# Altium project FIRST.PrjPcb
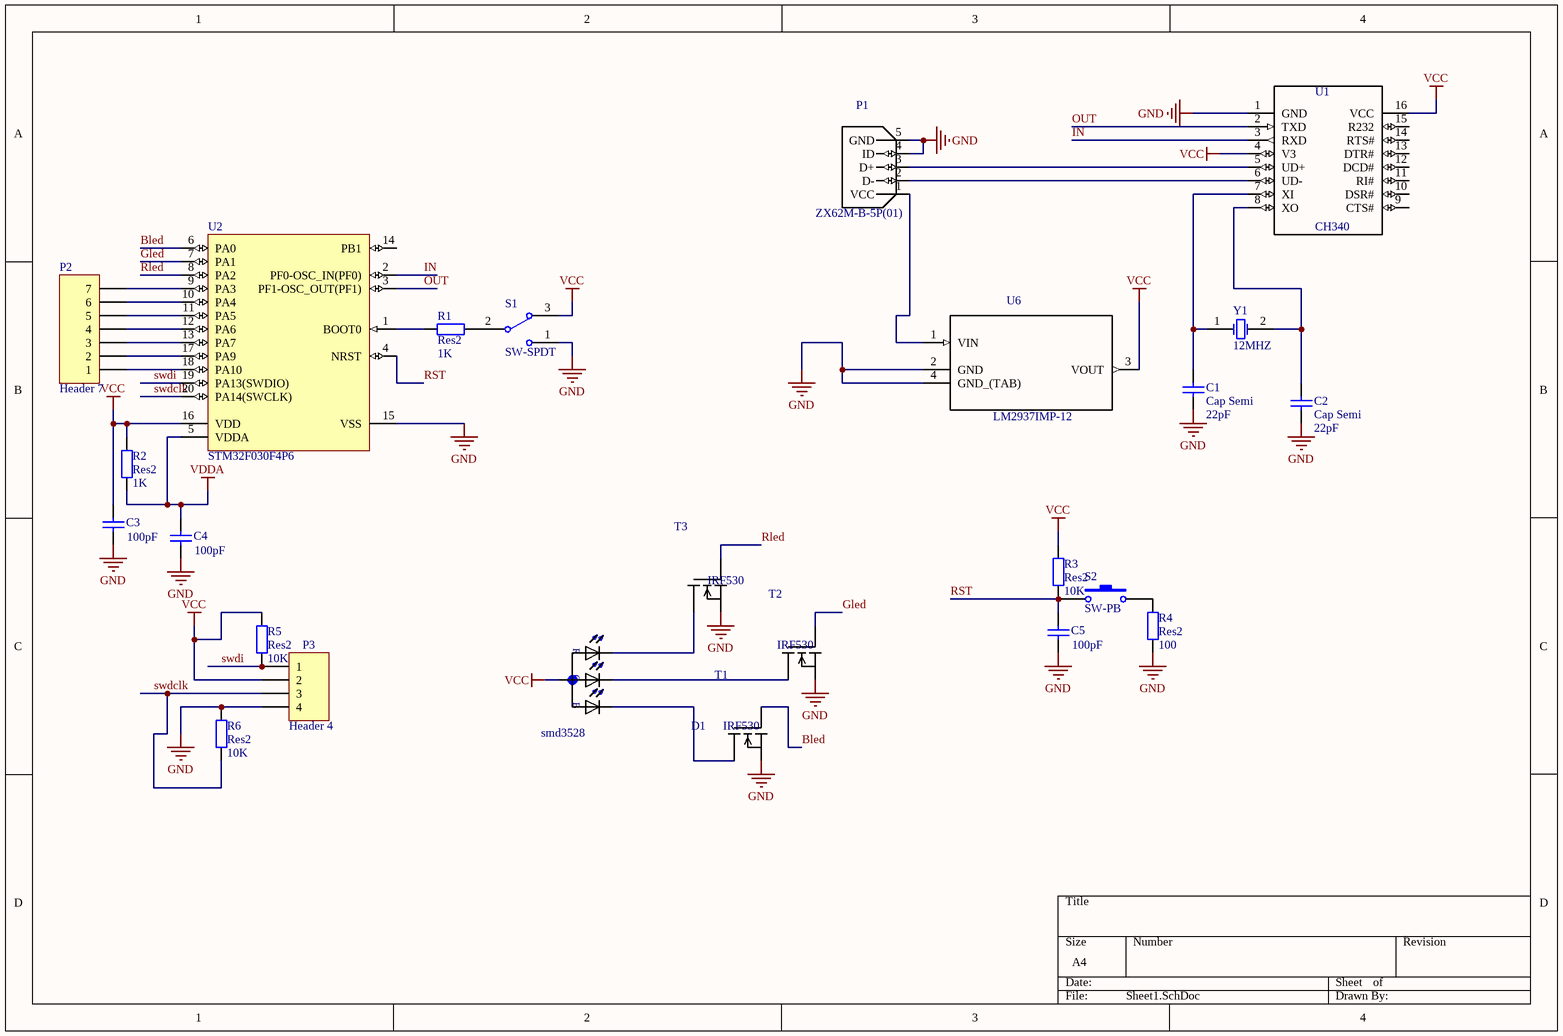
[diagram p0: Sheet1.SchDoc]
1 sheet, 24 parts. Net scope: global (net labels, ports and power ports of the same name join across sheets).
Board file: PCB3.PcbDoc

## Sheet Sheet1.SchDoc
size A4

### Parts
C1  Cap Semi  value 22pF  [C1206]
C2  Cap Semi  value 22pF  [C1206]
C3  value 100pF  [C1206]  (hidden comment: Cap Semi)
C4  value 100pF  [C1206]  (hidden comment: Cap Semi)
C5  value 100pF  [C1206]  (hidden comment: Cap Semi)
D1  smd3528  [PLCC4]
P1  ZX62M-B-5P(01)  [HRS_ZX62M-B-5P(01)]
P2  Header 7  [HDR1X7]
P3  Header 4  [HDR1X4]
R1  Res2  value 1K  [AXIAL-0.4]
R2  Res2  value 1K  [AXIAL-0.4]
R3  Res2  value 10K  [AXIAL-0.4]
R4  Res2  value 100  [AXIAL-0.4]
R5  Res2  value 10K  [AXIAL-0.4]
R6  Res2  value 10K  [AXIAL-0.4]
S1  SW-SPDT  [TL36WW15050]
S2  SW-PB  [SPST-2]
T1  IRF530  [TO220]
T2  IRF530  [TO220]
T3  IRF530  [TO220]
U1  CH340  [SO16]
U2  STM32F030F4P6  [STM-TSSOP20_N]
U6  LM2937IMP-12  [SOT230P700X180-4N]
Y1  12MHZ  [R38]

### Nets
GND: C1.1 C2.1 C3.1 C4.1 C5.1 P1.4(ID) P1.5(GND) P3.4 R4.1 R6.2 S1.1 T1.3(S) T2.3(S) T3.3(S) U1.1(GND) U2.15(VSS) U6.2(GND) U6.4(GND_(TAB))
VCC: C3.2 D1.2(CA) P3.2 R2.2 R3.2 R5.2 S1.3 U1.4(V3) U1.16(VCC) U2.16(VDD) U6.3(VOUT)
VDDA: C4.2 R2.1 U2.5(VDDA)
Bled: T1.1(G) U2.6(PA0)
Gled: T2.1(G) U2.7(PA1)
IN: U1.3(RXD) U2.2(PF0-OSC_IN(PF0))
OUT: U1.2(TXD) U2.3(PF1-OSC_OUT(PF1))
Rled: T3.1(G) U2.8(PA2)
RST: C5.2 R3.1 S2.1 U2.4(NRST)
swdclk: P3.3 R6.1 U2.20(PA14(SWCLK))
swdi: P3.1 R5.1 U2.19(PA13(SWDIO))
NetC1_2: C1.2 U1.7(XI) Y1.1(OSC1)
NetC2_2: C2.2 U1.8(XO) Y1.2(OSC2)
NetD1_1: D1.1(RC) T3.2(D)
NetD1_3: D1.3(BC) T1.2(D)
NetD1_4: D1.4(GC) T2.2(D)
NetP1_1: P1.1(VCC) U6.1(VIN)
NetP1_2: P1.2(D-) U1.6(UD-)
NetP1_3: P1.3(D+) U1.5(UD+)
NetP2_1: P2.1 U2.18(PA10)
NetP2_2: P2.2 U2.17(PA9)
NetP2_3: P2.3 U2.13(PA7)
NetP2_4: P2.4 U2.12(PA6)
NetP2_5: P2.5 U2.11(PA5)
NetP2_6: P2.6 U2.10(PA4)
NetP2_7: P2.7 U2.9(PA3)
NetR1_1: R1.1 U2.1(BOOT0)
NetR1_2: R1.2 S1.2
NetR4_2: R4.2 S2.2

Not connected (* = marked no-connect by the designer): U1 9(CTS#) 10(DSR#) 11(RI#) 12(DCD#) 13(DTR#) 14(RTS#) 15(R232); U2 14(PB1)

### Notes on the sheet
- (in symbol 67-23SDRSUGSUBC/TR8) R; G; B

### Library data of the parts
C1-C5 = Cap Semi: Capacitor (Semiconductor SIM Model); Published: 8-Jun-2000; LatestRevisionDate: 29-May-2009; LatestRevisionNote: IPC-7351 Footprint Added.; PackageReference: C1206; Publisher: Altium Limited; PackageDescription: Chip Capacitor
D1 = 67-23SDRSUGSUBC/TR8: SMD-LED RGB 112/216/57mcd PLCC; MF: Everlight; Availability: Warning; Price: None; MP: 67-23SDRSUGSUBC/TR8; Package: None; Value: *
P1 = ZX62M-B-5P(01): Conn Micro USB 2.0 Type B RCP 5 POS 0.65mm Solder RA SMD 5 Terminal 1 Port T/R; MF: Hirose; Availability: Unavailable; MP: ZX62M-B-5P(01); Price: None; Package: None; Value: *
P2 = Header 7: Header, 7-Pin; LatestRevisionDate: 17-Jul-2002; LatestRevisionNote: Re-released for DXP Platform.; Publisher: Altium Limited
P3 = Header 4: Header, 4-Pin; LatestRevisionDate: 17-Jul-2002; LatestRevisionNote: Re-released for DXP Platform.; Publisher: Altium Limited
R1-R6 = Res2: Resistor; Published: 8-Jun-2000; LatestRevisionDate: 17-Jul-2002; LatestRevisionNote: Re-released for DXP Platform.; PackageReference: AXIAL-0.4; Publisher: Altium Limited; PackageDescription: Axial Device, Thru-Hole; 2 Leads; 0.4 in Pin Spacing
S1 = SW-SPDT: SPDT Subminiature Toggle Switch, Right Angle Mounting, Vertical Actuation; Published: 24-Mar-1999; LatestRevisionDate: 17-Dec-2003; LatestRevisionNote: Schematic revised, PCB Footprint replaced.; DatasheetVersion: 05-Dec-2000; PackageReference: TL36WW15050; Publisher: Altium Limited; PackageDescription: Switch; 4 Leads; ComponentLink1Description: Manufacturer Link; ComponentLink1URL: http://www.apem.com
S2 = SW-PB: Switch; Published: 24-Mar-1999; LatestRevisionDate: 17-Jul-2002; LatestRevisionNote: Re-released for DXP Platform.; PackageReference: SPST-2; Publisher: Altium Limited; PackageDescription: Switch; 2 Leads
T1-T3 = IRF840: Trans MOSFET N-CH 500V 8A 3-Pin(3+Tab) TO-220AB; MF: Vishay; Availability: Bad; Package: TO-220 Vishay; Price: 3.90 USD; MP: IRF840; Value: *
U1 = CH340: Eaton / Cutler Hammer CH340 Circuit Breaker 40 Amp 240 Volt AC 3-Pole Plug-On Mount; MF: Eaton / Cutler Hammer; Package: None; Availability: Bad; MP: CH340; Price: 248.29 USD; Value: *
U2 = STM32F030F4P6: ARM Cortex-M0 32-bit MCU, 16 KB Flash, 4 KB Internal RAM, 15 I/Os, 20-pin TSSOP, -40 to 85 degC, Tube; FLASH Size (Prog) (kB): 16; I/Os (High Current): 15; Internal RAM Size (kB): 4; Operating Frequency(F) (Processor speed) (MHz): 48; Supply Voltage(Vcc) min (V): 2.4; DatasheetVersion: Rev. 1; PackageVersion: Rev. 1, 11/2012; PackageReference: TSSOP20; PackageDescription: 20-Pin Thin Shrink Small Outline Package, 6.5 x 4.4 mm Body, 0.65 mm Pitch; Supplier 1: Digi-Key; Supplier Part Number 1: 497-14044-5-ND; Supplier 2: Newark; Supplier Part Number 2: 06X3648; Supplier 3: Mouser; Supplier Part Number 3: 511-STM32F030F4P6; Core: ARM Cortex-M0; Packing: Tube; Mounting Technology: Surface Mount; PartNumber: STM32F030F4P6; ComponentLink1Description: Manufacturer URL; ComponentLink1URL: http://www.st.com/web/en/home.html; ComponentLink2Description: Datasheet; ComponentLink2URL: http://www.st.com/st-web-ui/static/active/en/resource/technical/document/datasheet/DM00088500.pdf; ComponentLink3Description: Package Specification; ComponentLink3URL: http://www.st.com/st-web-ui/static/active/en/resource/technical/document/datasheet/DM00065136.pdf
U6 = LM2937IMP-12: Sot-223; MF: Fairchild Semiconductor; Availability: Unavailable; MP: LM2937IMP-12; Price: None; Package: SOT-223 Fairchild Semiconductor; Value: *
Y1 = XTAL: Crystal Oscillator; Published: 8-Jun-2000; LatestRevisionDate: 17-Jul-2002; LatestRevisionNote: Re-released for DXP Platform.; PackageReference: R38; Publisher: Altium Limited; PackageDescription: Crystal, Thru-Hole; 2 Leads; Body 3.1 x 8.2 mm (Dia.xH)